# EAGLE schematic Humus_ethernet_dip_v1 (EAGLE 6.5.0)
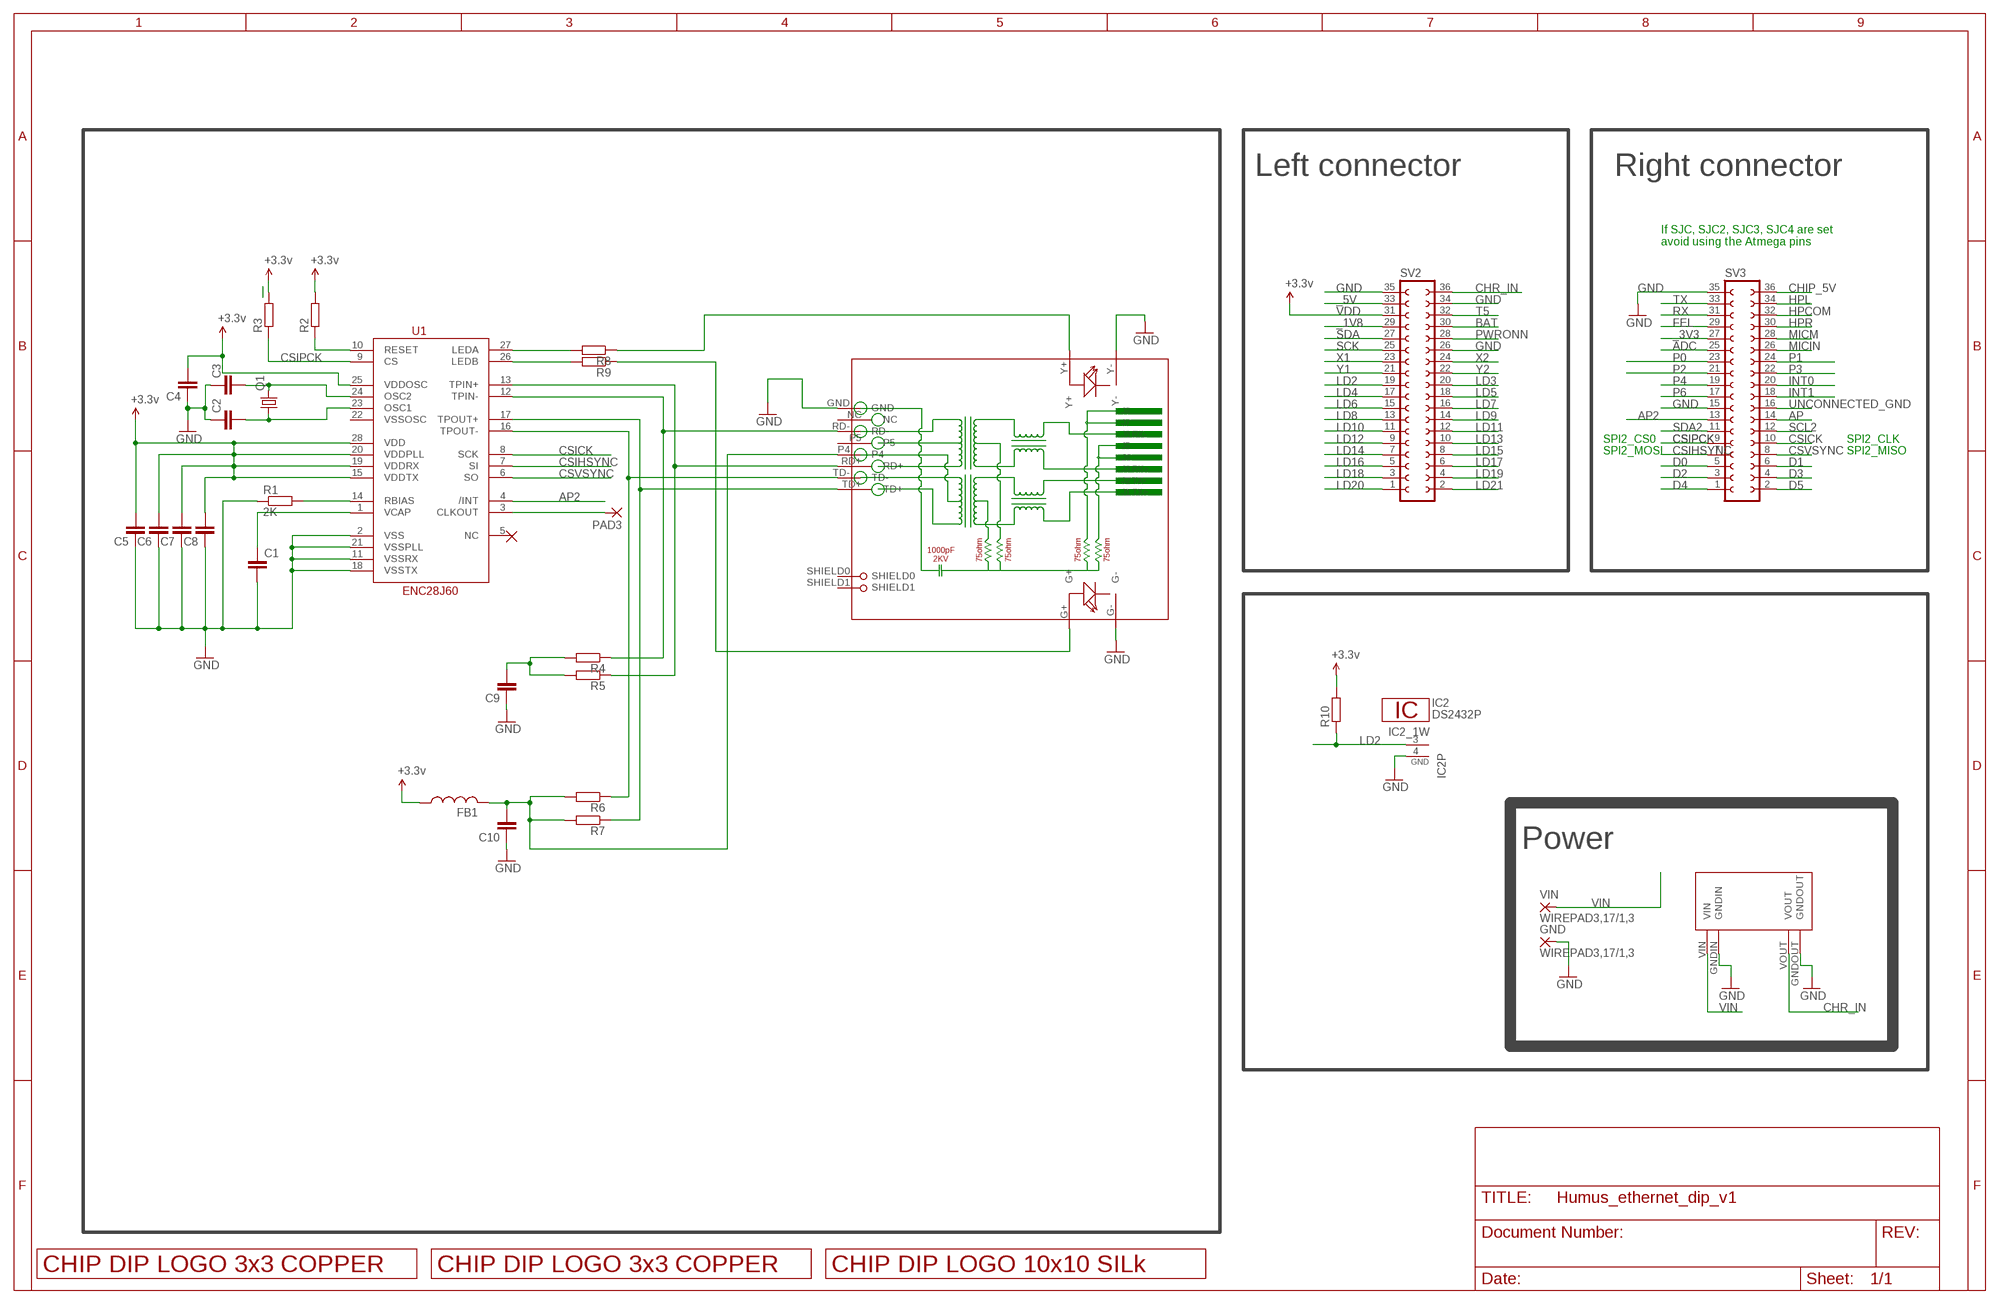
[diagram p0: schematic, sheet 1]

## Parts
C1  C-EUC0805  [C0805]
C2  C-EUC0805  [C0805]
C3  C-EUC0805  [C0805]
C4  C-EUC0805  [C0805]
C5  C-EUC0805  [C0805]
C6  C-EUC0805  [C0805]
C7  C-EUC0805  [C0805]
C8  C-EUC0805  [C0805]
C9  C-EUC0805  [C0805]
C10  C-EUC0805  [C0805]
FB1  FERRITE-BEADB  [0805]
GND  WIREPAD3,17/1,3  [3,17/1,3]
IC2  DS2432P  [TSOC6]
PAD3  WIREPADSMD1,27-254  [SMD1,27-2,54]
Q1  CRYSTALSM49  [SM49]
R1  2K  R-EU_R0805  [R0805]
R2  R-EU_R0805  [R0805]
R3  R-EU_R0805  [R0805]
R4  R-EU_R0805  [R0805]
R5  R-EU_R0805  [R0805]
R6  R-EU_R0805  [R0805]
R7  R-EU_R0805  [R0805]
R8  R-EU_R0805  [R0805]
R9  R-EU_R0805  [R0805]
R10  R-EU_R0805  [R0805]
RJ1  HR911105A  [HR911105A]
SV2  FE18-2  [FE18-2]
SV3  FE18-2  [FE18-2]
U1  ENC28J60  [SSOP28DB]
U$2  LOGO_3X3_COPPER  [LOGO_3X3_COPPER]
U$4  LOGO_3X3_COPPER  [LOGO_3X3_COPPER]
U$5  LOGO_10X10_SILK  [LOGO_10X10_SILK]
U$9  MP1584EN_FRAMELESS  [MP1584EN_FRAMELESS]
VIN  WIREPAD3,17/1,3  [3,17/1,3]

## Nets
_1V8: SV2.29
_3V3: SV3.27
_5V: SV2.33
ADC: SV3.25
AP: SV3.14
AP2: SV3.13 U1.4(/INT)
BAT: SV2.30
CHIP_5V: SV3.36
CHR_IN: SV2.36 U$9.VOUT
CSICK: SV3.10 U1.8(SCK)
CSIHSYNC: SV3.7 U1.7(SI)
CSIPCK: R3.1 SV3.9 U1.9(CS)
CSVSYNC: SV3.8 U1.6(SO)
CT: C10.2 FB1.2 R6.2 R7.2 RJ1.P4
D0: SV3.5
D1: SV3.6
D2: SV3.3
D3: SV3.4
D4: SV3.1
D5: SV3.2
FEL: SV3.29
GND: C1.2 C2.1 C3.1 C4.1 C5.1 C6.1 C7.1 C8.1 C9.1 C10.1 GND.1(P) IC2.4(GND) R1.1 RJ1.G- RJ1.GND RJ1.Y- SV2.26 SV2.34 SV2.35 SV3.15 SV3.35 U1.2(VSS) U1.11(VSSRX) U1.18(VSSTX) U1.21(VSSPLL) U$9.GNDIN U$9.GNDOUT
HPCOM: SV3.32
HPL: SV3.34
HPR: SV3.30
INT0: SV3.20
INT1: SV3.18
LD2: IC2.3(1W) R10.1 SV2.19
LD3: SV2.20
LD4: SV2.17
LD5: SV2.18
LD6: SV2.15
LD7: SV2.16
LD8: SV2.13
LD9: SV2.14
LD10: SV2.11
LD11: SV2.12
LD12: SV2.9
LD13: SV2.10
LD14: SV2.7
LD15: SV2.8
LD16: SV2.5
LD17: SV2.6
LD18: SV2.3
LD19: SV2.4
LD20: SV2.1
LD21: SV2.2
MICIN: SV3.26
MICM: SV3.28
N$1: C1.1 U1.1(VCAP)
N$2: R2.1 U1.10(RESET)
N$3: R1.2 U1.14(RBIAS)
N$6: C3.2 Q1.2 U1.24(OSC2)
N$7: C2.2 Q1.1 U1.23(OSC1)
N$10: R8.1 RJ1.Y+
N$11: R9.1 RJ1.G+
N$13: PAD3.1(P) U1.3(CLKOUT)
N$14: C9.2 R4.2 R5.2
N$15: R8.2 U1.27(LEDA)
N$16: R9.2 U1.26(LEDB)
P0: SV3.23
P1: SV3.24
P2: SV3.21
P3: SV3.22
P4: SV3.19
P6: SV3.17
PWRONN: SV2.28
RD+: R5.1 RJ1.RD+ U1.13(TPIN+)
RD-: R4.1 RJ1.RD- U1.12(TPIN-)
RX: SV3.31
SCK: SV2.25
SCL2: SV3.12
SDA: SV2.27
SDA2: SV3.11
T5: SV2.32
TD+: R7.1 RJ1.TD+ U1.17(TPOUT+)
TD-: R6.1 RJ1.TD- U1.16(TPOUT-)
TX: SV3.33
UNCONNECTED_GND: SV3.16
VDD: C4.2 C5.2 C6.2 C7.2 C8.2 FB1.1 R2.2 R3.2 R10.2 SV2.31 U1.15(VDDTX) U1.19(VDDRX) U1.20(VDDPLL) U1.25(VDDOSC) U1.28(VDD) ; supply symbol labelled +3.3v
VIN: U$9.VIN VIN.1(P)
X1: SV2.23
X2: SV2.24
Y1: SV2.21
Y2: SV2.22
Unconnected: RJ1.NC RJ1.P5 RJ1.SHIELD0 RJ1.SHIELD1 U1.5(NC) U1.22(VSSOSC)

## Notes on the sheet
- Left connector | Right connector
- If SJC, SJC2, SJC3, SJC4 are set 
  avoid using the Atmega pins
- SPI2_CS0 | SPI2_CLK
- SPI2_MOSI | SPI2_MISO
- Power

## Library data of the parts
C1-C10 = rcl:C-EU: CAPACITOR, European symbol
FB1 = m-pad-2.1:FERRITE-BEAD: Ferrite beads in various packages
GND PAD3 VIN = wirepad:WIREPAD: Wire PAD connect wire on PCB
IC2 = 1wire:DS2432: 1024-Bit Protected EEPROM with SHA-1 Engine This chip is a cryptographic device, providing 1024 Bits of EEPROM memory which may be written only after supplying the correct 64 bit secret. the secret cannot be read back from the device. The other features of this chip are like the DS2431. Please note the SHA-1 hash algorithm is considered weak if the data is not properly "padded". If you don't understand anything of this, don't use this chip. Author: Jan Kandziora <jjj@gmx.de>
Q1 = adafruit:CRYSTAL: CRYSTAL; OC_FARNELL: unknown; OC_NEWARK: unknown
R1-R10 = rcl:R-EU_: RESISTOR, European symbol
RJ1 = CONNECTER:HR911105A
SV2 SV3 = con-lsta:FE18-2: FEMALE HEADER; OC_FARNELL: unknown; OC_NEWARK: unknown
U1 = SparkFun-DigitalIC:ENC28J60: Microchip SPI 10Base ethernet IC
U$2 U$4 = logo:LOGO_3X3_COPPER
U$5 = logo:LOGO_10X10_SILK
U$9 = power_supply:MP1584EN_FRAMELESS